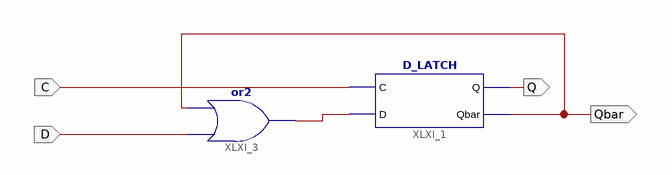
[diagram p0: schematic sheet 1]
// Xilinx ISE schematic D_LATCH_FLIP.sch (kintex7) as structural Verilog: 2 symbols, 4 ports
module D_LATCH_FLIP (
  input  D,
  input  C,
  output Q,
  output Qbar
);

  wire XLXN_7;

  D_LATCH XLXI_1 (.C(C), .D(XLXN_7), .Q(Q), .Qbar(Qbar));
  or XLXI_3 (XLXN_7, D, Qbar);
endmodule
